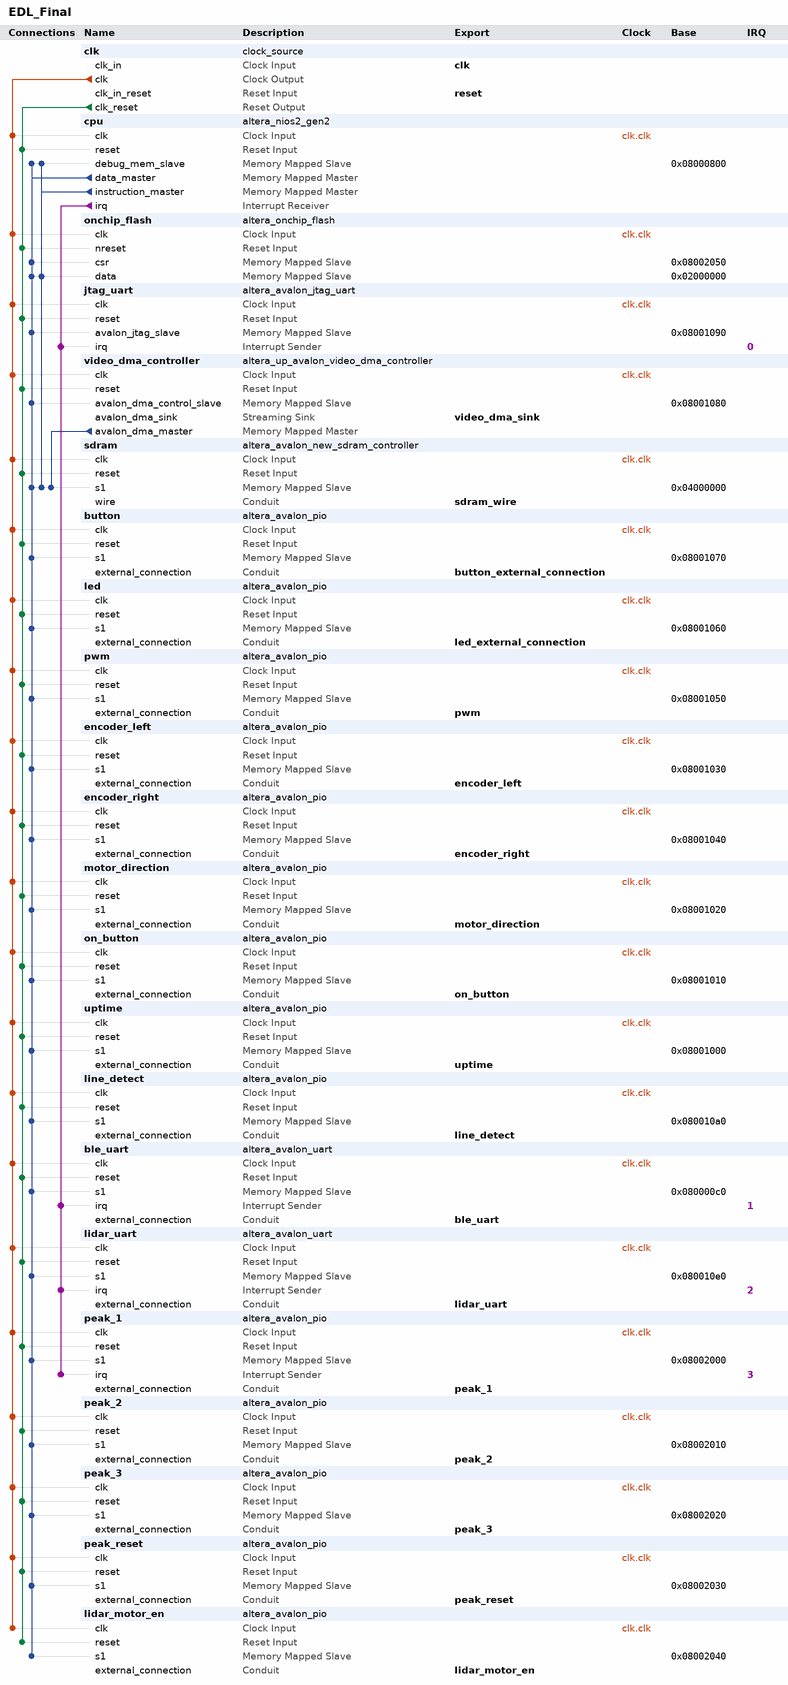
[diagram p0: system contents]
# Platform Designer (Qsys) system EDL_Final, MAX 10 10M50SAE144I7G
# Parameters at their usual value, and those the tool derives, are not listed.
package require -exact qsys 18.1
create_system EDL_Final
set_project_property DEVICE_FAMILY {MAX 10}
set_project_property DEVICE 10M50SAE144I7G

add_instance clk clock_source 18.1
set_instance_parameter_value clk clockFrequency 100000000

add_instance cpu altera_nios2_gen2 18.1
set_instance_parameter_value cpu dcache_size 2048
set_instance_parameter_value cpu exceptionSlave sdram.s1
set_instance_parameter_value cpu icache_size 4096
set_instance_parameter_value cpu impl Tiny
set_instance_parameter_value cpu resetSlave onchip_flash.data

add_instance onchip_flash altera_onchip_flash 18.1
set_instance_parameter_value onchip_flash CLOCK_FREQUENCY 100.0
set_instance_parameter_value onchip_flash CONFIGURATION_MODE {Single Uncompressed Image}
set_instance_parameter_value onchip_flash SECTOR_ACCESS_MODE {Read and write,Read and write,Read only,Hidden,Hidden}
set_instance_parameter_value onchip_flash initFlashContent false
set_instance_parameter_value onchip_flash initializationFileName altera_onchip_flash.hex
set_instance_parameter_value onchip_flash useNonDefaultInitFile false

add_instance jtag_uart altera_avalon_jtag_uart 18.1
set_instance_parameter_value jtag_uart simInteractiveOptions NO_INTERACTIVE_WINDOWS

add_instance video_dma_controller altera_up_avalon_video_dma_controller 18.0
set_instance_parameter_value video_dma_controller addr_mode Consecutive
set_instance_parameter_value video_dma_controller back_start_address 117440512
set_instance_parameter_value video_dma_controller color_bits 8
set_instance_parameter_value video_dma_controller color_planes 3
set_instance_parameter_value video_dma_controller dma_enabled true
set_instance_parameter_value video_dma_controller height 480
set_instance_parameter_value video_dma_controller mode {From Stream to Memory}
set_instance_parameter_value video_dma_controller start_address 100663296
set_instance_parameter_value video_dma_controller width 640

add_instance sdram altera_avalon_new_sdram_controller 18.1
set_instance_parameter_value sdram TAC 5.5
set_instance_parameter_value sdram TRCD 20.0
set_instance_parameter_value sdram TRP 20.0
set_instance_parameter_value sdram casLatency 3
set_instance_parameter_value sdram columnWidth 10
set_instance_parameter_value sdram dataWidth 16
set_instance_parameter_value sdram generateSimulationModel false
set_instance_parameter_value sdram model single_Micron_MT48LC4M32B2_7_chip
set_instance_parameter_value sdram numberOfBanks 4
set_instance_parameter_value sdram numberOfChipSelects 1
set_instance_parameter_value sdram powerUpDelay 100.0
set_instance_parameter_value sdram refreshPeriod 15.625
set_instance_parameter_value sdram rowWidth 13

add_instance button altera_avalon_pio 18.1
set_instance_parameter_value button direction Input
set_instance_parameter_value button width 2

add_instance led altera_avalon_pio 18.1
set_instance_parameter_value led direction Output
set_instance_parameter_value led width 10

add_instance pwm altera_avalon_pio 18.1
set_instance_parameter_value pwm direction Output
set_instance_parameter_value pwm width 16

add_instance encoder_left altera_avalon_pio 18.1
set_instance_parameter_value encoder_left direction Input
set_instance_parameter_value encoder_left width 32

add_instance encoder_right altera_avalon_pio 18.1
set_instance_parameter_value encoder_right direction Input
set_instance_parameter_value encoder_right width 32

add_instance motor_direction altera_avalon_pio 18.1
set_instance_parameter_value motor_direction direction Output
set_instance_parameter_value motor_direction width 4

add_instance on_button altera_avalon_pio 18.1
set_instance_parameter_value on_button direction Input
set_instance_parameter_value on_button width 1

add_instance uptime altera_avalon_pio 18.1
set_instance_parameter_value uptime direction Input
set_instance_parameter_value uptime width 32

add_instance line_detect altera_avalon_pio 18.1
set_instance_parameter_value line_detect direction Input
set_instance_parameter_value line_detect width 4

add_instance ble_uart altera_avalon_uart 18.1
set_instance_parameter_value ble_uart baud 9600
set_instance_parameter_value ble_uart dataBits 8
set_instance_parameter_value ble_uart fixedBaud true
set_instance_parameter_value ble_uart parity NONE
set_instance_parameter_value ble_uart stopBits 1

add_instance lidar_uart altera_avalon_uart 18.1
set_instance_parameter_value lidar_uart baud 115200
set_instance_parameter_value lidar_uart dataBits 8
set_instance_parameter_value lidar_uart fixedBaud true
set_instance_parameter_value lidar_uart parity NONE
set_instance_parameter_value lidar_uart stopBits 1

add_instance peak_1 altera_avalon_pio 18.1
set_instance_parameter_value peak_1 direction Input
set_instance_parameter_value peak_1 generateIRQ true
set_instance_parameter_value peak_1 width 32

add_instance peak_2 altera_avalon_pio 18.1
set_instance_parameter_value peak_2 direction Input
set_instance_parameter_value peak_2 width 32

add_instance peak_3 altera_avalon_pio 18.1
set_instance_parameter_value peak_3 direction Input
set_instance_parameter_value peak_3 width 32

add_instance peak_reset altera_avalon_pio 18.1
set_instance_parameter_value peak_reset direction Output
set_instance_parameter_value peak_reset width 1

add_instance lidar_motor_en altera_avalon_pio 18.1
set_instance_parameter_value lidar_motor_en direction Output
set_instance_parameter_value lidar_motor_en width 1

# connections
add_connection clk.clk ble_uart.clk clock
add_connection clk.clk button.clk clock
add_connection clk.clk cpu.clk clock
add_connection clk.clk encoder_left.clk clock
add_connection clk.clk encoder_right.clk clock
add_connection clk.clk jtag_uart.clk clock
add_connection clk.clk led.clk clock
add_connection clk.clk lidar_motor_en.clk clock
add_connection clk.clk lidar_uart.clk clock
add_connection clk.clk line_detect.clk clock
add_connection clk.clk motor_direction.clk clock
add_connection clk.clk on_button.clk clock
add_connection clk.clk onchip_flash.clk clock
add_connection clk.clk peak_1.clk clock
add_connection clk.clk peak_2.clk clock
add_connection clk.clk peak_3.clk clock
add_connection clk.clk peak_reset.clk clock
add_connection clk.clk pwm.clk clock
add_connection clk.clk sdram.clk clock
add_connection clk.clk uptime.clk clock
add_connection clk.clk video_dma_controller.clk clock
add_connection clk.clk_reset ble_uart.reset reset
add_connection clk.clk_reset button.reset reset
add_connection clk.clk_reset cpu.reset reset
add_connection clk.clk_reset encoder_left.reset reset
add_connection clk.clk_reset encoder_right.reset reset
add_connection clk.clk_reset jtag_uart.reset reset
add_connection clk.clk_reset led.reset reset
add_connection clk.clk_reset lidar_motor_en.reset reset
add_connection clk.clk_reset lidar_uart.reset reset
add_connection clk.clk_reset line_detect.reset reset
add_connection clk.clk_reset motor_direction.reset reset
add_connection clk.clk_reset on_button.reset reset
add_connection clk.clk_reset onchip_flash.nreset reset
add_connection clk.clk_reset peak_1.reset reset
add_connection clk.clk_reset peak_2.reset reset
add_connection clk.clk_reset peak_3.reset reset
add_connection clk.clk_reset peak_reset.reset reset
add_connection clk.clk_reset pwm.reset reset
add_connection clk.clk_reset sdram.reset reset
add_connection clk.clk_reset uptime.reset reset
add_connection clk.clk_reset video_dma_controller.reset reset
add_connection cpu.data_master ble_uart.s1 avalon
set_connection_parameter_value cpu.data_master/ble_uart.s1 baseAddress 0x080000c0
add_connection cpu.data_master button.s1 avalon
set_connection_parameter_value cpu.data_master/button.s1 baseAddress 0x08001070
add_connection cpu.data_master cpu.debug_mem_slave avalon
set_connection_parameter_value cpu.data_master/cpu.debug_mem_slave baseAddress 0x08000800
add_connection cpu.data_master encoder_left.s1 avalon
set_connection_parameter_value cpu.data_master/encoder_left.s1 baseAddress 0x08001030
add_connection cpu.data_master encoder_right.s1 avalon
set_connection_parameter_value cpu.data_master/encoder_right.s1 baseAddress 0x08001040
add_connection cpu.data_master jtag_uart.avalon_jtag_slave avalon
set_connection_parameter_value cpu.data_master/jtag_uart.avalon_jtag_slave baseAddress 0x08001090
add_connection cpu.data_master led.s1 avalon
set_connection_parameter_value cpu.data_master/led.s1 baseAddress 0x08001060
add_connection cpu.data_master lidar_motor_en.s1 avalon
set_connection_parameter_value cpu.data_master/lidar_motor_en.s1 baseAddress 0x08002040
add_connection cpu.data_master lidar_uart.s1 avalon
set_connection_parameter_value cpu.data_master/lidar_uart.s1 baseAddress 0x080010e0
add_connection cpu.data_master line_detect.s1 avalon
set_connection_parameter_value cpu.data_master/line_detect.s1 baseAddress 0x080010a0
add_connection cpu.data_master motor_direction.s1 avalon
set_connection_parameter_value cpu.data_master/motor_direction.s1 baseAddress 0x08001020
add_connection cpu.data_master on_button.s1 avalon
set_connection_parameter_value cpu.data_master/on_button.s1 baseAddress 0x08001010
add_connection cpu.data_master onchip_flash.csr avalon
set_connection_parameter_value cpu.data_master/onchip_flash.csr baseAddress 0x08002050
add_connection cpu.data_master onchip_flash.data avalon
set_connection_parameter_value cpu.data_master/onchip_flash.data baseAddress 0x02000000
add_connection cpu.data_master peak_1.s1 avalon
set_connection_parameter_value cpu.data_master/peak_1.s1 baseAddress 0x08002000
add_connection cpu.data_master peak_2.s1 avalon
set_connection_parameter_value cpu.data_master/peak_2.s1 baseAddress 0x08002010
add_connection cpu.data_master peak_3.s1 avalon
set_connection_parameter_value cpu.data_master/peak_3.s1 baseAddress 0x08002020
add_connection cpu.data_master peak_reset.s1 avalon
set_connection_parameter_value cpu.data_master/peak_reset.s1 baseAddress 0x08002030
add_connection cpu.data_master pwm.s1 avalon
set_connection_parameter_value cpu.data_master/pwm.s1 baseAddress 0x08001050
add_connection cpu.data_master sdram.s1 avalon
set_connection_parameter_value cpu.data_master/sdram.s1 baseAddress 0x04000000
add_connection cpu.data_master uptime.s1 avalon
set_connection_parameter_value cpu.data_master/uptime.s1 baseAddress 0x08001000
add_connection cpu.data_master video_dma_controller.avalon_dma_control_slave avalon
set_connection_parameter_value cpu.data_master/video_dma_controller.avalon_dma_control_slave baseAddress 0x08001080
add_connection cpu.instruction_master cpu.debug_mem_slave avalon
set_connection_parameter_value cpu.instruction_master/cpu.debug_mem_slave baseAddress 0x08000800
add_connection cpu.instruction_master onchip_flash.data avalon
set_connection_parameter_value cpu.instruction_master/onchip_flash.data baseAddress 0x02000000
add_connection cpu.instruction_master sdram.s1 avalon
set_connection_parameter_value cpu.instruction_master/sdram.s1 baseAddress 0x04000000
add_connection video_dma_controller.avalon_dma_master sdram.s1 avalon
set_connection_parameter_value video_dma_controller.avalon_dma_master/sdram.s1 baseAddress 0x04000000
add_connection cpu.irq ble_uart.irq interrupt
set_connection_parameter_value cpu.irq/ble_uart.irq irqNumber 1
add_connection cpu.irq jtag_uart.irq interrupt
set_connection_parameter_value cpu.irq/jtag_uart.irq irqNumber 0
add_connection cpu.irq lidar_uart.irq interrupt
set_connection_parameter_value cpu.irq/lidar_uart.irq irqNumber 2
add_connection cpu.irq peak_1.irq interrupt
set_connection_parameter_value cpu.irq/peak_1.irq irqNumber 3

# exported interfaces
add_interface ble_uart conduit end
set_interface_property ble_uart EXPORT_OF ble_uart.external_connection
add_interface button_external_connection conduit end
set_interface_property button_external_connection EXPORT_OF button.external_connection
add_interface clk clock sink
set_interface_property clk EXPORT_OF clk.clk_in
add_interface encoder_left conduit end
set_interface_property encoder_left EXPORT_OF encoder_left.external_connection
add_interface encoder_right conduit end
set_interface_property encoder_right EXPORT_OF encoder_right.external_connection
add_interface led_external_connection conduit end
set_interface_property led_external_connection EXPORT_OF led.external_connection
add_interface lidar_motor_en conduit end
set_interface_property lidar_motor_en EXPORT_OF lidar_motor_en.external_connection
add_interface lidar_uart conduit end
set_interface_property lidar_uart EXPORT_OF lidar_uart.external_connection
add_interface line_detect conduit end
set_interface_property line_detect EXPORT_OF line_detect.external_connection
add_interface motor_direction conduit end
set_interface_property motor_direction EXPORT_OF motor_direction.external_connection
add_interface on_button conduit end
set_interface_property on_button EXPORT_OF on_button.external_connection
add_interface peak_1 conduit end
set_interface_property peak_1 EXPORT_OF peak_1.external_connection
add_interface peak_2 conduit end
set_interface_property peak_2 EXPORT_OF peak_2.external_connection
add_interface peak_3 conduit end
set_interface_property peak_3 EXPORT_OF peak_3.external_connection
add_interface peak_reset conduit end
set_interface_property peak_reset EXPORT_OF peak_reset.external_connection
add_interface pwm conduit end
set_interface_property pwm EXPORT_OF pwm.external_connection
add_interface reset reset sink
set_interface_property reset EXPORT_OF clk.clk_in_reset
add_interface sdram_wire conduit end
set_interface_property sdram_wire EXPORT_OF sdram.wire
add_interface uptime conduit end
set_interface_property uptime EXPORT_OF uptime.external_connection
add_interface video_dma_sink avalon_streaming sink
set_interface_property video_dma_sink EXPORT_OF video_dma_controller.avalon_dma_sink

set_interconnect_requirement {$system} qsys_mm.clockCrossingAdapter HANDSHAKE
set_interconnect_requirement {$system} qsys_mm.enableEccProtection FALSE
set_interconnect_requirement {$system} qsys_mm.insertDefaultSlave FALSE
set_interconnect_requirement {$system} qsys_mm.maxAdditionalLatency 1

save_system EDL_Final.qsys
